# Altium schematic sheet TopLevel.SchDoc
size A; SheetNumber: 1; SheetTotal: 6
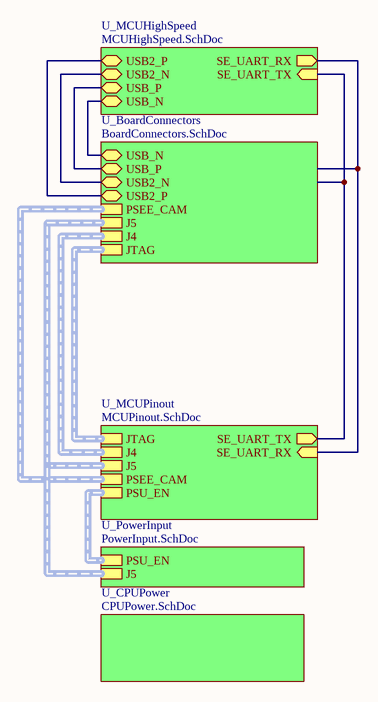
[diagram p0: TopLevel.SchDoc]

## Sub-sheets
U_BoardConnectors = BoardConnectors.SchDoc: USB_N (bidir), USB_P (bidir), PSEE_CAM (harness Camera harness), J5 (harness Header J5), J4 (harness Header J4), JTAG (harness JTAG), USB2_N (bidir), USB2_P (bidir)
U_CPUPower = CPUPower.SchDoc: no entries
U_MCUHighSpeed = MCUHighSpeed.SchDoc: USB_P (bidir), USB_N (bidir), USB2_P (bidir), USB2_N (bidir), SE_UART_TX (in), SE_UART_RX (out)
U_MCUPinout = MCUPinout.SchDoc: JTAG (harness JTAG), J4 (harness Header J4), J5 (harness Header J5), SE_UART_RX (in), SE_UART_TX (out), PSEE_CAM (harness Camera harness), PSU_EN (harness Power supply enable)
U_PowerInput = PowerInput.SchDoc: PSU_EN (harness Power supply enable), J5 (harness Power supply enable)

## Nets
(unnamed): sheet U_BoardConnectors/USB_N, sheet U_MCUHighSpeed/USB_N
(unnamed): sheet U_BoardConnectors/USB_P, sheet U_MCUHighSpeed/USB_P
(unnamed): sheet U_BoardConnectors/USB2_N, sheet U_MCUHighSpeed/USB2_N
(unnamed): sheet U_BoardConnectors/USB2_P, sheet U_MCUHighSpeed/USB2_P
(unnamed): sheet U_MCUHighSpeed/SE_UART_TX, sheet U_MCUPinout/SE_UART_TX
(unnamed): sheet U_MCUHighSpeed/SE_UART_RX, sheet U_MCUPinout/SE_UART_RX

## Buses and harness runs
harness sheet U_BoardConnectors/J4 = sheet U_MCUPinout/J4
harness sheet U_BoardConnectors/J5 = sheet U_MCUPinout/J5 = sheet U_PowerInput/J5
harness sheet U_BoardConnectors/JTAG = sheet U_MCUPinout/JTAG
harness sheet U_BoardConnectors/PSEE_CAM = sheet U_MCUPinout/PSEE_CAM
harness sheet U_MCUPinout/PSU_EN = sheet U_PowerInput/PSU_EN